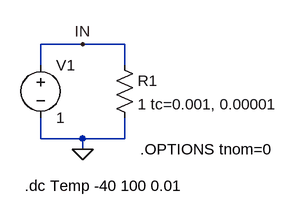
[diagram p0: schematic Fig_2-84_R_2nd-TC.asc]
Fig_2-84_R_2nd-TC.asc, the LTspice schematic file:
Version 4
SHEET 1 880 680
WIRE 176 96 112 96
WIRE 240 96 176 96
WIRE 112 128 112 96
WIRE 240 128 240 96
WIRE 112 240 112 208
WIRE 176 240 112 240
WIRE 240 240 240 208
WIRE 240 240 176 240
WIRE 176 256 176 240
FLAG 176 256 0
FLAG 176 96 IN
SYMBOL res 224 112 R0
SYMATTR InstName R1
SYMATTR Value 1 tc=0.001, 0.00001
SYMBOL voltage 112 112 R0
WINDOW 123 0 0 Left 2
WINDOW 39 0 0 Left 2
SYMATTR InstName V1
SYMATTR Value 1
TEXT 88 312 Left 2 !.dc Temp -40 100 0.01
TEXT 264 256 Left 2 !.OPTIONS tnom=0

The netlist it stands for:
* Fig_2-84_R_2nd-TC.asc
R1 IN 0 1 tc=0.001, 0.00001
V1 IN 0 1
.dc Temp -40 100 0.01
.OPTIONS tnom=0
.backanno
.end